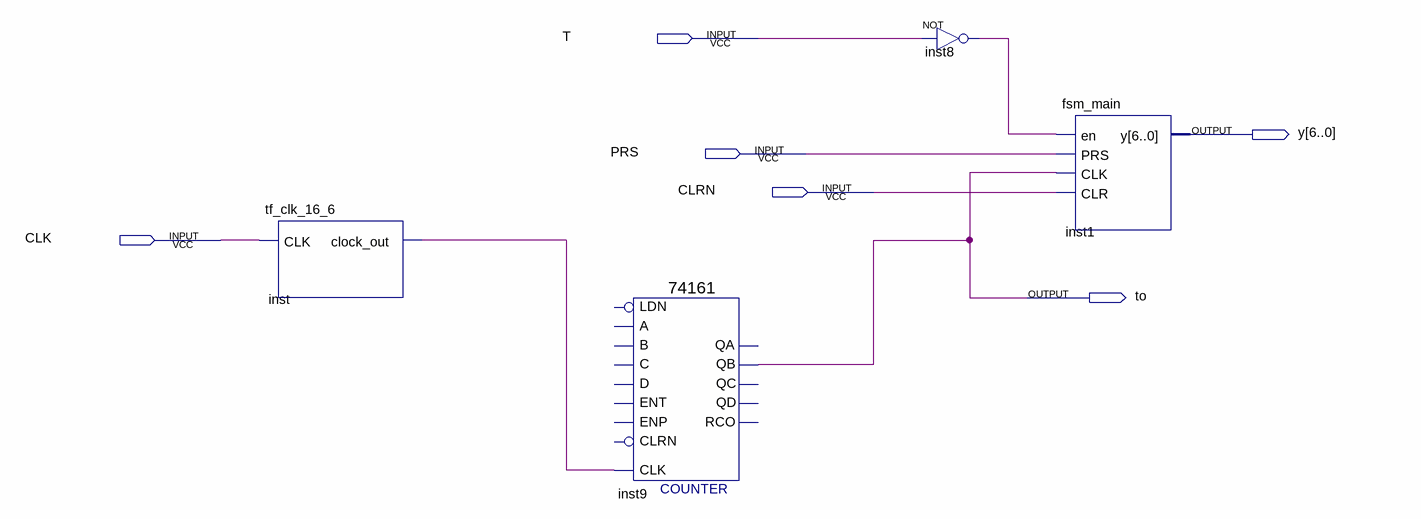
[diagram p0: schematic sheet]
// Quartus schematic the_mainbdf.bdf as structural Verilog: 4 symbols, 6 pins
module the_mainbdf (
  input  T,
  input  PRS,
  input  CLRN,
  input  CLK,
  output [6:0] y,
  output to
);

  wire inst8_out, inst_clock_out;

  tf_clk_16_6 inst (.CLK(CLK), .clock_out(inst_clock_out));
  \74161  inst9 (.CLK(inst_clock_out), .QB(to));  // open: CLRN, ENP, LDN, A, D, ENT, B, C, QD, QC, QA, RCO
  not inst8 (inst8_out, T);
  fsm_main inst1 (.en(inst8_out), .PRS(PRS), .CLK(to), .CLR(CLRN), .y(y));
endmodule
